# Altium schematic sheet Processor.SchDoc
size Letter; SheetNumber: 1; SheetTotal: 2
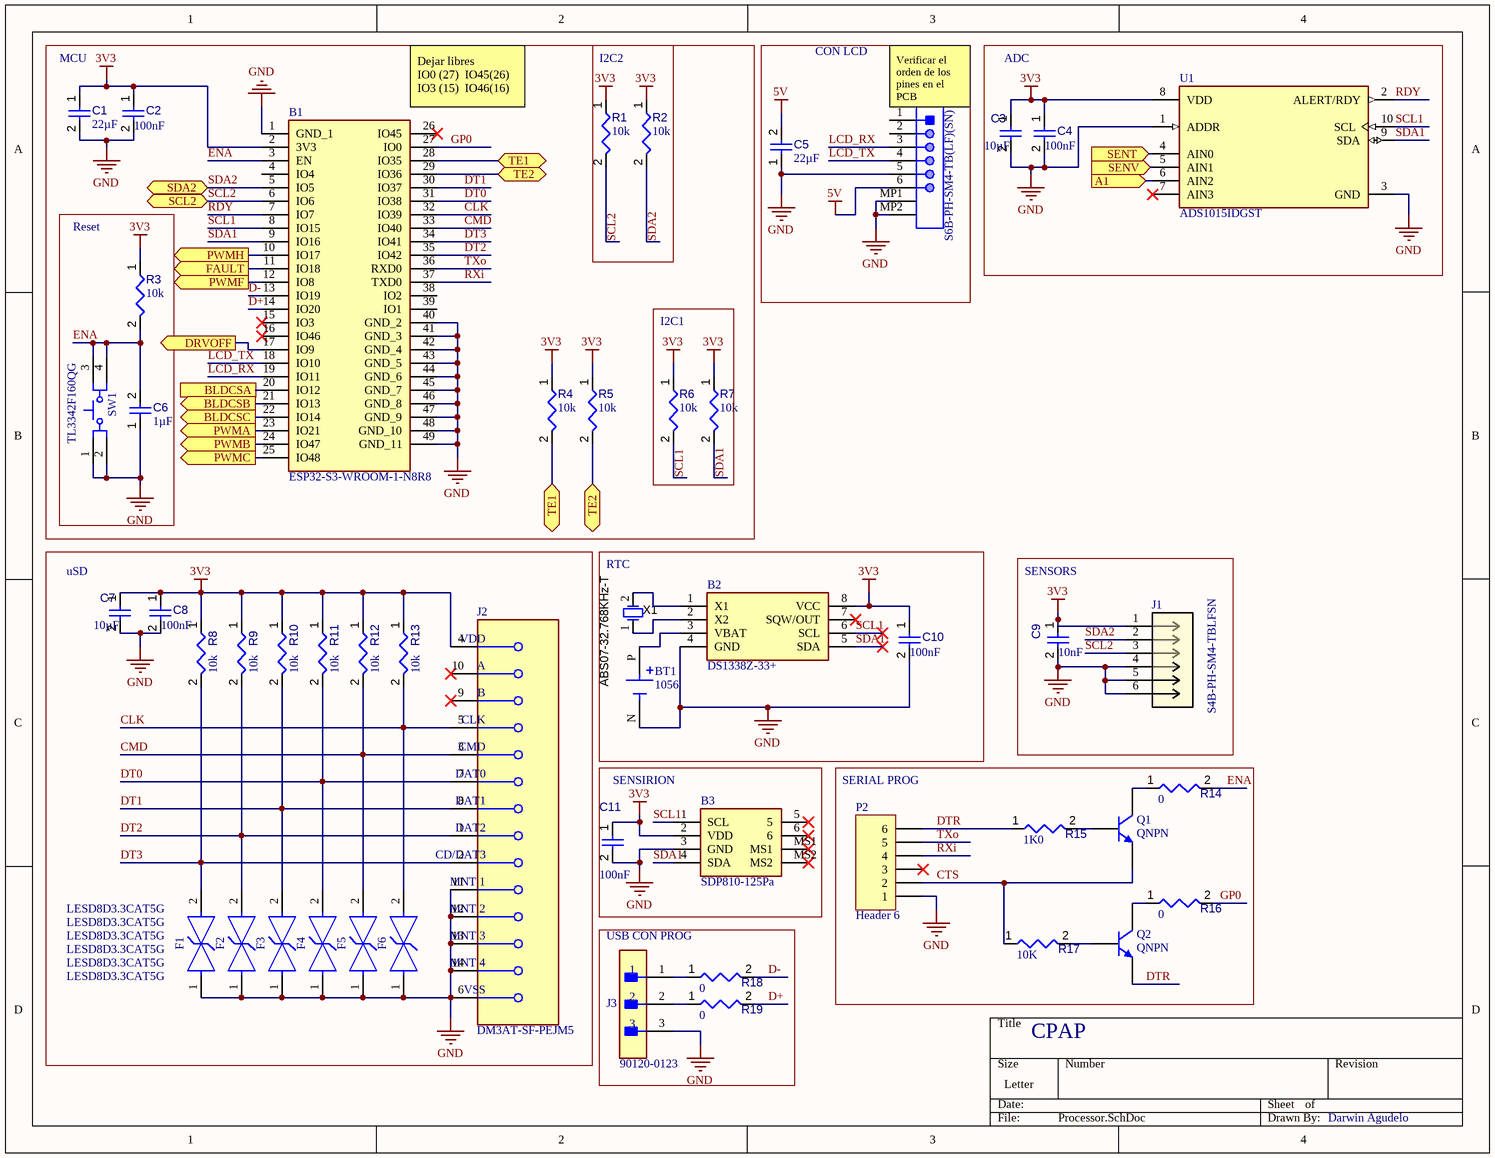
[diagram p0: Processor.SchDoc]

## Parts
B1  ESP32-S3-WROOM-1-N8R8  [ESP32S3WROOM1N8R8]
B2  DS1338Z-33+  [SOIC127P600X175-8N]
B3  SDP810-125Pa  [SDP810125Pa]
BT1  1056  [BAT_1056]
C1  value 22µF  [CAPC0805(2012)145_L]  (hidden comment: Capacitor 22µF +/-40% 16V 0805)
C2  value 100nF  [CAPC1608X90X40NL10T20]  (hidden comment: Capacitor 100 nF +/-10% 50 V 0603)
C3  value 10µF  [CAPC0805(2012)145_L]  (hidden comment: Capacitor 22µF +/-40% 16V 0805)
C4  value 100nF  [CAPC1608X90X40NL10T20]  (hidden comment: Capacitor 100 nF +/-10% 50 V 0603)
C5  value 22µF  [CAPC0805(2012)145_L]  (hidden comment: Capacitor 22µF +/-40% 16V 0805)
C6  value 1µF  [CAPC0603(1608)100_L]  (hidden comment: Capacitor 1µF +/-40% 50V 0603)
C7  value 10µF  [CAPC0805(2012)145_L]  (hidden comment: Capacitor 22µF +/-40% 16V 0805)
C8  value 100nF  [CAPC1608X90X40NL10T20]  (hidden comment: Capacitor 100 nF +/-10% 50 V 0603)
C9  value 10nF  [CAPC1608X90X40NL10T20]  (hidden comment: Capacitor 100 nF +/-10% 50 V 0603)
C10  value 100nF  [CAPC1608X90X40NL10T20]  (hidden comment: Capacitor 100 nF +/-10% 50 V 0603)
C11  value 100nF  [CAPC1608X90X40NL10T20]  (hidden comment: Capacitor 100 nF +/-10% 50 V 0603)
F1  LESD8D3.3CAT5G  [FP-ESDALC5-1BM2-MFG]
F2  LESD8D3.3CAT5G  [FP-ESDALC5-1BM2-MFG]
F3  LESD8D3.3CAT5G  [FP-ESDALC5-1BM2-MFG]
F4  LESD8D3.3CAT5G  [FP-ESDALC5-1BM2-MFG]
F5  LESD8D3.3CAT5G  [FP-ESDALC5-1BM2-MFG]
F6  LESD8D3.3CAT5G  [FP-ESDALC5-1BM2-MFG]
J1  S4B-PH-SM4-TBLFSN  [CONN_S4B-PH-SM4-TBLFSN_JST]
J2  DM3AT-SF-PEJM5  [FP-DM3AT-SF-PEJM5-MFG]
J3  90120-0123  [FP-90120-0123-MFG]
P1  S6B-PH-SM4-TB(LF)(SN)  [JST-S6B-PH-SM4-TB(LF)(SN)_V]
P2  Header 6  [HDR1X6]
Q1  QNPN  [SOT-23B_L]
Q2  QNPN  [SOT-23B_L]
R1  value 10k  [RESC1608X55X25ML10T15]  (hidden comment: Resistor 10k +/-1% 0603 100 mW)
R2  value 10k  [RESC1608X55X25ML10T15]  (hidden comment: Resistor 10k +/-1% 0603 100 mW)
R3  value 10k  [RESC1608X55X25ML10T15]  (hidden comment: Resistor 10k +/-1% 0603 100 mW)
R4  value 10k  [RESC1608X55X25ML10T15]  (hidden comment: Resistor 10k +/-1% 0603 100 mW)
R5  value 10k  [RESC1608X55X25ML10T15]  (hidden comment: Resistor 10k +/-1% 0603 100 mW)
R6  value 10k  [RESC1608X55X25ML10T15]  (hidden comment: Resistor 10k +/-1% 0603 100 mW)
R7  value 10k  [RESC1608X55X25ML10T15]  (hidden comment: Resistor 10k +/-1% 0603 100 mW)
R8  value 10k  [RESC1608X55X25ML10T15]  (hidden comment: Resistor 10k +/-1% 0603 100 mW)
R9  value 10k  [RESC1608X55X25ML10T15]  (hidden comment: Resistor 10k +/-1% 0603 100 mW)
R10  value 10k  [RESC1608X55X25ML10T15]  (hidden comment: Resistor 10k +/-1% 0603 100 mW)
R11  value 10k  [RESC1608X55X25ML10T15]  (hidden comment: Resistor 10k +/-1% 0603 100 mW)
R12  value 10k  [RESC1608X55X25ML10T15]  (hidden comment: Resistor 10k +/-1% 0603 100 mW)
R13  value 10k  [RESC1608X55X25ML10T15]  (hidden comment: Resistor 10k +/-1% 0603 100 mW)
R14  value 0  [RESC1608X55X25ML10T15]  (hidden comment: Resistor 10k +/-1% 0603 100 mW)
R15  value 1K0  [RESC1608X55X25ML10T15]  (hidden comment: Resistor 10k +/-1% 0603 100 mW)
R16  value 0  [RESC1608X55X25ML10T15]  (hidden comment: Resistor 10k +/-1% 0603 100 mW)
R17  value 10K  [RESC1608X55X25ML10T15]  (hidden comment: Resistor 10k +/-1% 0603 100 mW)
R18  value 0  [RESC1608X55X25ML10T15]  (hidden comment: Resistor 10k +/-1% 0603 100 mW)
R19  value 0  [RESC1608X55X25ML10T15]  (hidden comment: Resistor 10k +/-1% 0603 100 mW)
SW1  TL3342F160QG  [ESWI-TL3342F160QG_V]
U1  ADS1015IDGST  [FP-DGS0010A-MFG]
X1  ABS07-32.768KHz-T  [ABRA-ABS07-2_V]

## Blocks framed on the sheet
MCU: B1 C1 C2 R4 R5
I2C2: R1 R2
CON LCD: C5 P1
ADC: C3 C4 U1
Reset: C6 R3 SW1
I2C1: R6 R7
uSD: C7 C8 F1-F6 J2 R8-R13
RTC: B2 BT1 C10 X1
SENSORS: C9 J1
SENSIRION: B3 C11
SERIAL PROG: P2 Q1 Q2 R14-R17
USB CON PROG: J3 R18 R19

## Ports
A1 (in), BLDCSA (out), BLDCSB (out), BLDCSC (out), DRVOFF (out), FAULT (out), PWMA (out), PWMB (out), PWMC (out), PWMF (out), PWMH (out), SCL2 (bidir), SDA2 (bidir), SENT (in), SENV (in), TE1 (bidir), TE2 (bidir)

## Nets
3V3: B1.2(3V3) B2.8(VCC) B3.2(VDD) C1.1 C2.1 C3.1 C4.1 C7.1 C8.1 C9.1 C10.1 C11.1 J1.1 J2.4(VDD) R1.1 R2.1 R3.1 R4.1 R5.1 R6.1 R7.1 R8.1 R9.1 R10.1 R11.1 R12.1 R13.1 U1.8(VDD)
5V: C5.2 P1.6
GND: B1.1(GND_1) B1.40(GND_2) B1.41(GND_3) B1.42(GND_4) B1.43(GND_5) B1.44(GND_6) B1.45(GND_7) B1.46(GND_8) B1.47(GND_9) B1.48(GND_10) B1.49(GND_11) B2.4(GND) B3.3(GND) BT1.N(NEG) C1.2 C2.2 C3.2 C4.2 C5.1 C6.1 C7.2 C8.2 C9.2 C10.2 C11.2 F1.1(I/O1) F2.1(I/O1) F3.1(I/O1) F4.1(I/O1) F5.1(I/O1) F6.1(I/O1) J1.4 J1.5 J1.6 J2.6(VSS) J2.11(MNT_1) J2.12(MNT_2) J2.13(MNT_3) J2.14(MNT_4) J3.3 P1.5 P1.MP1 P1.MP2 P2.1 SW1.1 SW1.2 U1.1(ADDR) U1.3(GND)
A1: U1.6(AIN2) ; port A1
BLDCSA: B1.20(IO12) ; port BLDCSA
BLDCSB: B1.21(IO13) ; port BLDCSB
BLDCSC: B1.22(IO14) ; port BLDCSC
CLK: B1.32(IO39) F6.2(I/O2) J2.5(CLK) R13.2
CMD: B1.33(IO40) F5.2(I/O2) J2.3(CMD) R12.2
CTS: P2.2 Q1.3(E) R17.1
D+: B1.14(IO20) R19.2
D-: B1.13(IO19) R18.2
DRVOFF: B1.17(IO9) ; port DRVOFF
DT0: B1.31(IO38) F4.2(I/O2) J2.7(DAT0) R11.2
DT1: B1.30(IO37) F3.2(I/O2) J2.8(DAT1) R10.2
DT2: B1.35(IO42) F2.2(I/O2) J2.1(DAT2) R9.2
DT3: B1.34(IO41) F1.2(I/O2) J2.2(CD/DAT3) R8.2
DTR: P2.6 Q2.3(E) R15.1
ENA: B1.3(EN) C6.2 R3.2 R14.2 SW1.3 SW1.4
FAULT: B1.11(IO18) ; port FAULT
GP0: B1.27(IO0) R16.2
LCD_RX: B1.19(IO11) P1.3
LCD_TX: B1.18(IO10) P1.4
PWMA: B1.23(IO21) ; port PWMA
PWMB: B1.24(IO47) ; port PWMB
PWMC: B1.25(IO48) ; port PWMC
PWMF: B1.12(IO8) ; port PWMF
PWMH: B1.10(IO17) ; port PWMH
RDY: B1.7(IO7) U1.2(ALERT/RDY)
RXi: B1.37(TXD0) P2.4
SCL1: B1.8(IO15) B2.6(SCL) B3.1(SCL) R6.2 U1.10(SCL)
SCL2: B1.6(IO6) J1.3 R1.2 ; port SCL2
SDA1: B1.9(IO16) B2.5(SDA) B3.4(SDA) R7.2 U1.9(SDA)
SDA2: B1.5(IO5) J1.2 R2.2 ; port SDA2
SENT: U1.4(AIN0) ; port SENT
SENV: U1.5(AIN1) ; port SENV
TE1: B1.28(IO35) R4.2 ; port TE1
TE2: B1.29(IO36) R5.2 ; port TE2
TXo: B1.36(RXD0) P2.5
NetB2_1: B2.1(X1) X1.2(OSC2)
NetB2_2: B2.2(X2) X1.1(OSC1)
NetB2_3: B2.3(VBAT) BT1.P(POS)
NetJ3_1: J3.1 R18.1
NetJ3_2: J3.2 R19.1
NetQ1_1: Q1.1(C) R14.1
NetQ1_2: Q1.2(B) R15.2
NetQ2_1: Q2.1(C) R16.1
NetQ2_2: Q2.2(B) R17.2

Not connected (* = marked no-connect by the designer): B1 4(IO4) 15(IO3)* 16(IO46)* 26(IO45)* 38(IO2) 39(IO1); B2 7(SQW/OUT)*; B3 5* 6* MS1* MS2*; J2 9(B)* 10(A)*; P1 1 2; P2 3*; U1 7(AIN3)*

## Notes on the sheet
- (near B1) Dejar libres
  IO0 (27)  IO45(26)
  IO3 (15)  IO46(16)
- (near P1) Verificar el orden de los pines en el PCB
- CPAP
- Darwin Agudelo

## Library data of the parts
B1 = ESP32-S3-WROOM-1-N8R8: WiFi Modules - 802.11 (Engineering Samples Only) SMD Module, ESP32-S3R8 with 8 MB Octal PSRAM Die, 8 MB Quad SPI flash, PCB Antenna; Manufacturer_Name: Espressif Systems; Geometry.Height: 3.25mm; Manufacturer_Part_Number: ESP32-S3-WROOM-1-N8R8; Mouser Part Number: 356-EP32S3WROOM1N8R8; Mouser Price/Stock: https://www.mouser.co.uk/ProductDetail/Espressif-Systems/ESP32-S3-WROOM-1-N8R8?qs=7D1LtPJG0i3%2F28hKFavOpQ%3D%3D; Arrow Part Number: *; Arrow Price/Stock: *; Datasheet Link: https://www.espressif.com/sites/default/files/documentation/esp32-s3-wroom-1_wroom-1u_datasheet_en.pdf
B2 = DS1338Z-33+: Real Time Clock Serial 56Byte Maxim DS1338Z-33+ Real Time Clock  Battery Backup, Calendar, Clock, NV Timekeeping RAM, 56B RAM 8-Pin SOIC; Manufacturer_Name: Analog Devices; Geometry.Height: 1.75mm; Manufacturer_Part_Number: DS1338Z-33+; Mouser Part Number: 700-DS1338Z-33; Mouser Price/Stock: https://www.mouser.co.uk/ProductDetail/Analog-Devices-Maxim-Integrated/DS1338Z-33%2b?qs=0Y9aZN%252BMVCVblIXsYVg1wg%3D%3D; Arrow Part Number: DS1338Z-33+; Arrow Price/Stock: https://www.arrow.com/en/products/ds1338z-33/maxim-integrated?region=europe; Datasheet Link: https://datasheet.datasheetarchive.com/originals/distributors/SFDatasheet-4/sf-00086235.pdf
B3 = SDP810-125Pa: Sensirion SDP810-125PA, Differential Pressure Sensor +125Pa 4-Pin; Geometry.Height: 24mm; Manufacturer_Name: Sensirion; Manufacturer_Part_Number: SDP810-125Pa; Mouser Part Number: 403-SDP810-125PA; Mouser Price/Stock: https://www.mouser.co.uk/ProductDetail/Sensirion/SDP810-125PA?qs=KwaGCOX4wIaNl5Uit0G7rw%3D%3D; Arrow Part Number: SDP810-125PA; Arrow Price/Stock: https://www.arrow.com/en/products/sdp810-125pa/sensirion-ag?region=europe; Datasheet Link: https://www.mouser.com/datasheet/2/682/Sensirion_Differential_Pressure_Sensors_SDP8xx_Dig-1511125.pdf
C1 C3 C5 C7 = CMP-001-00081-4: Chip Capacitor, 22µF +/-40%, 16V, 0805, Thickness 1.45 mm; Tolerance: 5%; Voltage Rating: 16V; Mounting Technology: SMT; Pins: 2; Max Operating Temperature: 85°C; Case/Package: 0805; Min Operating Temperature: -55°C
C2 C4 C8-C11 = CMP-001-00017-6: Chip Capacitor, 100 nF, +/- 10%, 50 V, 0603 (1608 Metric); Capacitor Type: Ceramic; Voltage Rating: 50V; Max Operating Temperature: 125°C; Min Operating Temperature: -55°C; Case/Package: 0603; Mounting Technology: SM; Pins: 2; Tolerance: 10%; RoHS Compliant: True
C6 = CMP-001-00078-4: Chip Capacitor, 1µF +/-40%, 50V, 0603, Thickness 1 mm; Tolerance: 10%; Case/Package: 0603; Pins: 2; Max Operating Temperature: 85°C; Voltage Rating: 50V; Mounting Technology: SMT; Min Operating Temperature: -55°C
F1-F6 = CMP-00355-46355615-1: ESDALC5-1BM2 ESD Suppressors / TVS Diodes Single Line Transil Vbr 5V min 26pF 0; Polarity: Bidirectional; Leakage Current: 50nA; Number of Channels: 1; Max Breakdown Voltage: 8V; Max Power Dissipation: 150W; ESD Protection: Yes; Max Reverse Leakage Current: 60nA; Power Line Protection: No; Clamping Voltage: 17.5V; Peak Pulse Current: 9A; Schedule B: 8536300000, 8536300000; Lead Free: Lead Free; Max Operating Temperature: 150°C; Direction: Bidirectional; Min Operating Temperature: -55°C; RoHS: Compliant; Breakdown Voltage: 5V; Number of Pins: 2; Capacitance: 26pF; Mount: Surface Mount; Lifecycle Status: Production; Max Repetitive Reverse Voltage (Vrrm): 5V; Min Breakdown Voltage: 5V; Length: 1mm; Reverse Standoff Voltage: 5V; Termination: SMD/SMT; Depth: 600µm; NexarPartId: 46355615; Number of Bidirectional Channels: 1; Radiation Hardening: No; REACH SVHC: No SVHC; Width: 650µm; Element Configuration: Single; Packaging: Tape and Reel; Height: 450µm; Peak Pulse Power: 150W; Composition: Zener
J1 = S4B-PH-SM4-TBLFSN: No Description Available; Mfr_Name: JST; RefDes: RefDes; Type: Type
J2 = CMP-2000-05150-2: CONN MICRO SD CARD PUSH-PUSH R/A; Current Rating: 500mA; Number of Contacts: 8; Pitch: 1.1mm; Gender: Female; Connector Type: Connector; Max Voltage Rating (AC): 125V; Min Operating Temperature: -25°C; Length: 15.95mm; Packaging: Tape and Reel; Width: 13.85mm; Flammability Rating: UL94 V-0; Termination: SMD/SMT; Contact Material: Copper Alloy; Depth: 15.95mm; Radiation Hardening: No; Number of Rows: 1; Max Operating Temperature: 85°C; Housing Material: Polymer; Height: 1.68mm; Package Quantity: 1; Orientation: Right Angle; REACH SVHC: No SVHC; Mount: Surface Mount; Max Current Rating: 500mA; Number of Positions: 8; Lead Free: Lead Free; Contact Plating: Gold; Voltage Rating: 125V
J3 = CMP-04776-000237-1: CONN HEADER VERT 3POS 2.54MM; Number of Circuits: 3; Max Voltage Rating (DC): 350.35kV; Contact Resistance: 20mR; Gender: Male; Voltage Rating (AC): 350V; Glow Wire Compliant: Non-compliant; Current Rating: 3A; Contact Post Length: 2.9mm; Number of Contacts: 3; Number of Rows: 1; Max Operating Temperature: 125°C; Orientation: Vertical; Number of Positions: 3; Packaging: Tray; Contact Mating Length: 6.75mm; Housing Color: Black; Termination: Solder; Contact Material: Brass; Radiation Hardening: No; Lead Free: Lead Free; Pitch: 2.54mm; RoHS Compliant: Yes; Voltage Rating: 350V; Contact Plating: Tin; Color: Black; Min Operating Temperature: -55°C; Mount: Through Hole; Housing Material: Polyester; Series: 90120; Contact Gender: Male; REACH SVHC: No SVHC
P1 = CMP-2000-07027-1: Male Header, Pitch 2 mm, 1 x 6 Position, Height 5.5 mm, -25 to 85 degC; Manufacturer: JST; Pitch: 2mm; Style/Orientation: RightAngleHeader/Plug; No of Positions: 6; Package Reference: S6B-PH-SM4-TB(LF)(SN); Type: ShroudedHeader; Package Description: Male Header, Pitch 2 mm, 1 x 6 Position, Height 5.5 mm; Mounting Technology: SurfaceMount; Datasheet Version: 11/2008; Termination: Solder; Datasheet URL: https://datasheet.ciiva.com/11747/0900766b80df0d9d-11747278.pdf; Manufacturer URL: http://www.jst.com/home2.html
P2 = Header 6: Header, 6-Pin; LatestRevisionDate: 17-Jul-2002; LatestRevisionNote: Re-released for DXP Platform.; Publisher: Altium Limited
Q1 Q2 = QNPN: NPN Bipolar Transistor; Published: 8-Jun-2000; LatestRevisionDate: 29-May-2009; LatestRevisionNote: IPC-7351 Footprint Added.; PackageVersion: Aug-1999; PackageReference: SOT-23B; Publisher: Altium Limited; PackageDescription: 3-Pin SOT-23 Package 0.95 mm Pitch, 2.4 mm Lead Span
R1-R19 = CMP-009-00017-5: Chip Resistor, 10 KOhm, +/- 1%, 01 W, -55 to 155 degC, 0603 (1608 Metric); Voltage Rating: 50V; Power: 100mW; RoHS Compliant: True; Min Operating Temperature: -55°C; Pins: 2; Case/Package: 0603; Mounting Technology: SM; Max Operating Temperature: 155°C; Tolerance: 1%
SW1 = CMP-011-00008-2: Tactile Switch, SPST-NO, 50 mA, 12 V, 4-Pin SMD, RoHS, Tape and Reel; Manufacturer: E-Switch; Operating Force: 1.6N; Current Rating: 50mA; Throw Configuration: SPST; Max Voltage Rating (DC): 12V; Datasheet URL: http://spec_sheets.e-switch.com/specs/P010632.pdf; Manufacturer URL: http://www.e-switch.ch/en/; Mounting Technology: SM; Case/Package: TL3342F160QG; Package Quantity: 3000; Contact Material: Silver; Package Description: 4-Pin Surface Mount Device, Body 5 x 5 mm, Pitch 6.3 mm; Package Reference: TL3342F160QG; Datasheet Version: Rev. I, 12/2010; Voltage Rating (DC): 12V; Contact Plating: Silver; RoHS Compliant: True; Packaging: TapeandReel
U1 = CMP-0003-00377-3: IC ADC 12BIT SIGMA-DELTA 10VSSOP; Supply Type: Single; Number of Converters: 1; Number of Bits: 12; Number of Inputs: 4; Sampling Rate: 3.3KS/s; Conversion Rate: 3300S/s; Min Supply Voltage: 2V; Interface: I2C; Operating Supply Voltage: 3.3V; Polarity: Bipolar; Nominal Supply Current: 150uA; Integral Nonlinearity (INL): 0.5LSB; Max Power Dissipation: 900uW; Max Supply Voltage (DC): 5.5V; Resolution: 12b; Width: 3mm; Min Operating Temperature: -40°C; Contact Plating: Gold; Number of A/D Converters: 1; Max Operating Temperature: 125°C; Height: 1.02mm; Case/Package: VSSOP; Package Quantity: 250; Number of Elements: 1; Lead Free: Lead Free; Number of Pins: 10; Radiation Hardening: No; Termination: SMD/SMT; Length: 3mm; Min Supply Voltage (DC): 2V; Power Dissipation: 900uW; Number of Channels: 4; Max Supply Voltage: 5.5V; REACH SVHC: No SVHC; Packaging: Tape and Reel
X1 = CMP-003-00022-2: Low Profile Crystal, 32.768 kHz, +/- 20 ppm, 12.5 pF, -40 to 85 degC, 2-Pin SMD, Pb-Free, Tape and Reel; Manufacturer: Abracon; Frequency Tolerance: 20ppm; ESR: 70k; Load Capacitance: 12.5pF; Max Operating Temperature: 85°C; Mounting Technology: SM; Manufacturer URL: http://www.abracon.com/; Pins: 2; Packaging: TapeandReel; Tolerance: 20ppm; Min Operating Temperature: -40°C; Frequency: 32.768kHz; Datasheet URL: http://www.abracon.com/Resonators/ABS07.pdf; RoHS Compliant: True; Package Description: 2-Pin Surface Mount Device, Body 3.2 x 1.5 mm; Datasheet Version: Aug-15; Package Reference: ABS07-2; Package URL: http://www.abracon.com/Support/PackageDrawing/Resonators/ABS07.PDF; Package Quantity: 3000; Case/Package: CSMD
BT1 = 1056: Value: *; Package: None; MP: 1056; Price: None; Availability: Unavailable